# EasyEDA Pro project ZeptoWatch.eprj, board PCB1
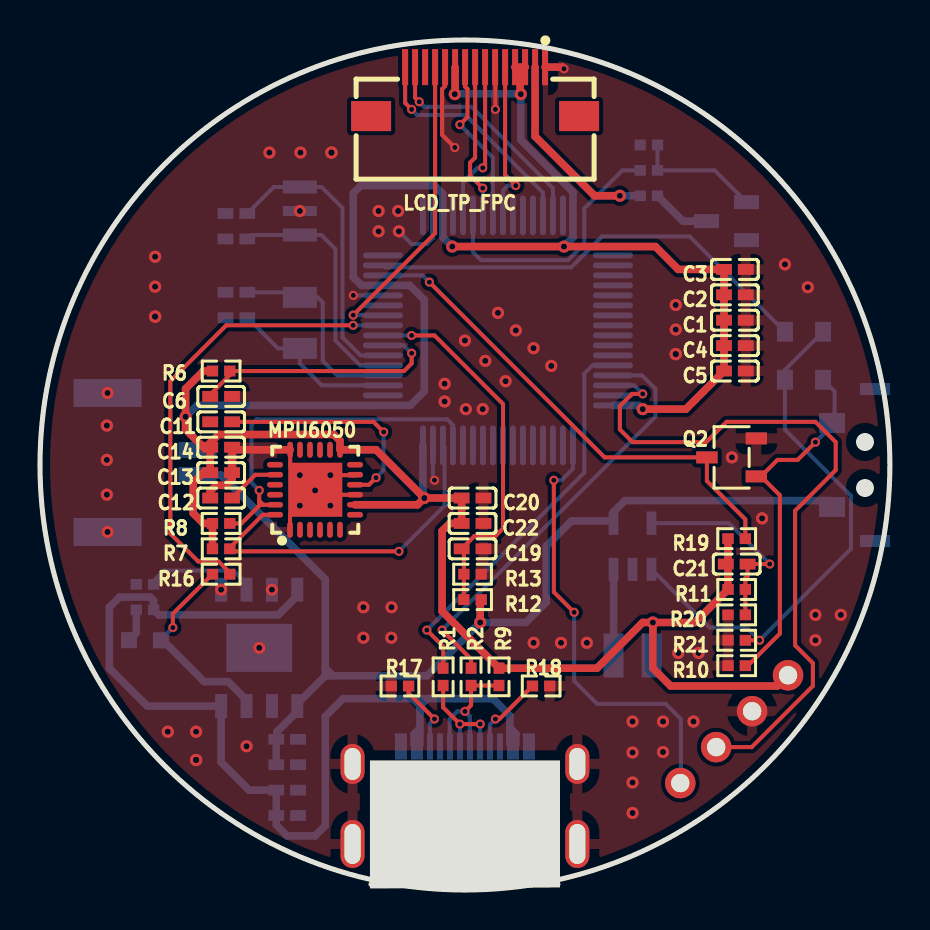
[diagram p6: board, top side]
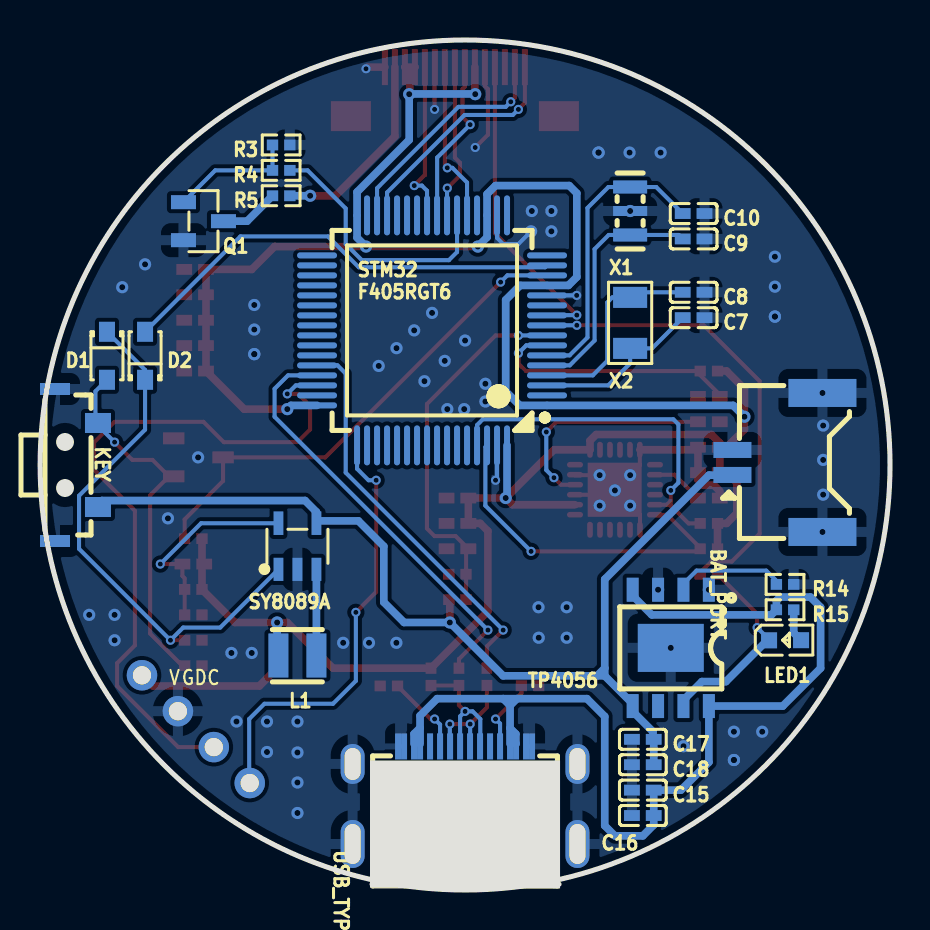
[diagram p7: board, bottom side, seen from below]

Outline 42.5 x 42.5 mm; copper layers: Top Layer, Bottom Layer. Coordinates in mm from the lower left corner of the outline.
Outline path: circle c21.25,21.25 r21.25
Stack: Top Layer 0.035mm / Dielectric1 1.51mm FR4 er 4.5 / Bottom Layer 0.035mm

## Design rules (mm)
spacing safeClearance (default): track to track 0.102, other pairs 0 to 0.3
track width trackWidth (default): min 0.127, default 0.254, max 2.54
differential pair differentialPair (default): width min 0.127, default 0.254, max 2.54; gap min 0.152, default 0.152
via viaSize (default): diameter min 0.305, default 0.457, max 10; hole min 0.152, default 0.254, max 5.999

## Placement (name value [footprint] x y rotation side)
BAT_PORT  1.25K-CB-2PWB  [CONN-SMD_2P-P1.25_L5.5-W7.7-2PWB]  5.63 21.38 90 bottom
C1  100nF  [C0402]  34.75 28.49 0 top
C2  100nF  [C0402]  34.75 29.76 0 top
C3  100nF  [C0402]  34.75 31.03 0 top
C4  100nF  [C0402]  34.75 27.22 0 top
C5  100nF  [C0402]  34.75 25.95 180 top
C6  100nF  [C0402]  9.06 24.68 180 top
C7  10pF  [C0402]  9.82 28.62 0 bottom
C8  10pF  [C0402]  9.82 29.89 0 bottom
C9  20pF  [C0402]  9.82 32.55 0 bottom
C10  20pF  [C0402]  9.82 33.82 0 bottom
C11  100nF  [C0402]  9.06 23.41 180 top
C12  2.2nF  [C0402]  9.06 19.6 180 top
C13  100nF  [C0402]  9.06 20.87 180 top
C14  100nF  [C0402]  9.06 22.14 180 top
C15  10uF  [C0402]  12.36 4.99 180 bottom
C16  100nF  [C0402]  12.36 3.72 0 bottom
C17  10uF  [C0402]  12.36 7.53 180 bottom
C18  100nF  [C0402]  12.36 6.26 0 bottom
C19  100nF  [C0402]  21.63 17.06 0 top
C20  10uF  [C0402]  21.63 19.6 180 top
C21  22pF  [C0402]  34.84 16.3 0 top
C22  100nF  [C0402]  21.63 18.33 0 top
D1  B5819WS  [SOD-323_L1.8-W1.3-LS2.5-FD]  39.16 26.71 90 bottom
D2  B5819WS  [SOD-323_L1.8-W1.3-LS2.5-FD]  37.25 26.71 270 bottom
KEY  TS-KG012EV  [SW-SMD_TS-KG012EV]  40.68 21.25 270 bottom
L1  2.2uH  [IND-SMD_L2.5-W2.0_SWPA252012S]  29.63 11.72 0 bottom
LCD_TP_FPC  KH-FG0.5-H2.0-15PIN  [FPC-SMD_15P-P0.50_KINGHELM_KH-FG0.5-H2.0-15PIN]  21.76 39.92 0 top
LED1  D-060306B1  [LED0603-RD]  5.25 12.49 180 bottom
MPU6050  MPU-6050  [QFN-24_L4.0-W4.0-P0.50-BL-EP2.7]  13.75 20.01 0 top
NOREF  -  [Pad_e10368]  35.61 8.94 0 top
NOREF#2  -  [Pad_e10372]  32.02 5.35 0 top
NOREF#3  -  [Pad_e10366]  37.41 10.74 0 top
NOREF#4  -  [Pad_e10369]  33.81 7.14 0 top
Q1  SS8050  [SOT-23-3_L2.9-W1.3-P1.90-LS2.4-BR]  34.33 33.44 0 bottom
Q2  AO3400A  [SOT-23-3_L2.9-W1.6-P1.90-LS2.8-BR]  34.59 21.63 0 top
R1  22Ω  [R0402]  20.16 10.66 90 top
R2  22Ω  [R0402]  21.56 10.66 90 top
R3  10kΩ  [R0402]  30.45 37.25 180 bottom
R4  1kΩ  [R0402]  30.45 35.98 0 bottom
R5  10Ω  [R0402]  30.45 34.71 180 bottom
R6  47kΩ  [R0402]  9.06 25.95 180 top
R7  2.2kΩ  [R0402]  9.06 17.06 0 top
R8  2.2kΩ  [R0402]  9.06 18.33 0 top
R9  1.5kΩ  [R0402]  22.95 10.66 270 top
R10  10kΩ  [R0402]  34.84 11.22 180 top
R11  100kΩ  [R0402]  34.84 15.03 0 top
R12  20kΩ  [R0402]  21.63 14.52 180 top
R13  20kΩ  [R0402]  21.63 15.79 0 top
R14  2kΩ  [R0402]  5.25 15.28 0 bottom
R15  1kΩ  [R0402]  5.25 14.01 180 bottom
R16  2kΩ  [R0402]  9.06 15.79 0 top
R17  5.1kΩ  [R0402]  18 10.2 0 top
R18  5.1kΩ  [R0402]  25.06 10.2 0 top
R19  100kΩ  [R0402]  34.84 17.57 180 top
R20  22kΩ  [R0402]  34.84 13.76 0 top
R21  100kΩ  [R0402]  34.84 12.49 0 top
STM32
F405RGT6  -  [LQFP-64_L10.0-W10.0-P0.50-LS12.0-BL]  22.9 27.98 90 bottom
SY8089A  SY8089A1AAC  [SOT-23-5_L3.0-W1.7-P0.95-LS2.8-BL]  29.63 17.19 180 bottom
TP4056  TP4056  [ESOP-8_L4.9-W3.9-P1.27-LS6.0-BL-EP]  10.96 12.11 0 bottom
USB_TYPEC  TYPE-C-16M-005  [USB-C-SMD_TYPE-C-16M-005]  21.25 4.74 180 bottom
X1  8MHz  [OSC-SMD_3P-L3.2-W1.3-P1.2-L]  13 33.95 90 bottom
X2  32.768kHz  [OSC-SMD_L3.2-W1.5]  13 28.36 270 bottom

## Footprints (pads in the part's own frame, mm; a bottom-side part is the same pattern mirrored in y, then rotated)
C0402
  rect 0.79x0.54 smd: 1(-0.545,0) 2(0.545,0)
CONN-SMD_2P-P1.25_L5.5-W7.7-2PWB
  rect 0.8x1.9 smd: 1(-0.625,2.25) 2(0.625,2.25)
  rect 1.4x3.4 smd: 3(3.475,-2.25) 4(-3.475,-2.25)
ESOP-8_L4.9-W3.9-P1.27-LS6.0-BL-EP
  rect 0.6x1.2 smd: 1(-1.905,-2.909) 2(-0.635,-2.909) 3(0.635,-2.909) 4(1.905,-2.909) 5(1.905,2.909) 6(0.635,2.909) 7(-0.635,2.909) 8(-1.905,2.909)
  rect 3.3x2.4 smd: 9(0,0)
FPC-SMD_15P-P0.50_KINGHELM_KH-FG0.5-H2.0-15PIN
  rect 0.3x1.8 smd: 1(3.5,1.225) 2(3,1.225) 3(2.5,1.225) 4(2,1.225) 5(1.5,1.225) 6(1,1.225) 7(0.5,1.225) 8(0,1.225) 9(-0.5,1.225) 10(-1,1.225) 11(-1.5,1.225) 12(-2,1.225) 13(-2.499,1.225) 14(-3,1.225) 15(-3.499,1.225)
  rect 2x1.5 smd: 16(-5.2,-1.225) 17(5.2,-1.225)
IND-SMD_L2.5-W2.0_SWPA252012S
  rect 1.001x2.2 smd: 1(-0.95,0) 2(0.95,0)
LED0603-RD
  rect 0.8x0.8 smd: 1(-0.799,-0.004) 2(0.799,0.004)
LQFP-64_L10.0-W10.0-P0.50-LS12.0-BL
  oval 0.3x2 smd: 1(-3.75,-5.75) 2(-3.25,-5.75) 3(-2.75,-5.75) 4(-2.25,-5.75) 5(-1.75,-5.75) 6(-1.25,-5.75) 7(-0.75,-5.75) 8(-0.25,-5.75) 9(0.25,-5.75) 10(0.75,-5.75) 11(1.25,-5.75) 12(1.75,-5.75) 13(2.25,-5.75) 14(2.75,-5.75) 15(3.25,-5.75) 16(3.75,-5.75) 33(3.75,5.75) 34(3.25,5.75) 35(2.75,5.75) 36(2.25,5.75) 37(1.75,5.75) 38(1.25,5.75) 39(0.75,5.75) 40(0.25,5.75) 41(-0.25,5.75) 42(-0.75,5.75) 43(-1.25,5.75) 44(-1.75,5.75) 45(-2.25,5.75) 46(-2.75,5.75) 47(-3.25,5.75) 48(-3.75,5.75)
  oval 2x0.3 smd: 17(5.75,-3.75) 18(5.75,-3.25) 19(5.75,-2.75) 20(5.75,-2.25) 21(5.75,-1.75) 22(5.75,-1.25) 23(5.75,-0.75) 24(5.75,-0.25) 25(5.75,0.25) 26(5.75,0.75) 27(5.75,1.25) 28(5.75,1.75) 29(5.75,2.25) 30(5.75,2.75) 31(5.75,3.25) 32(5.75,3.75) 49(-5.75,3.75) 50(-5.75,3.25) 51(-5.75,2.75) 52(-5.75,2.25) 53(-5.75,1.75) 54(-5.75,1.25) 55(-5.75,0.75) 56(-5.75,0.25) 57(-5.75,-0.25) 58(-5.75,-0.75) 59(-5.75,-1.25) 60(-5.75,-1.75) 61(-5.75,-2.25) 62(-5.75,-2.75) 63(-5.75,-3.25) 64(-5.75,-3.75)
OSC-SMD_3P-L3.2-W1.3-P1.2-L
  rect 0.65x1.7 smd: 1(-1.199,0) 3(1.199,0)
  rect 0.5x1.7 smd: 2(0,0)
OSC-SMD_L3.2-W1.5
  rect 1.049x1.7 smd: 1(-1.275,0) 2(1.275,0)
Pad_e10366
  round 1.524 hole 0.914: 1(0,0)
Pad_e10368
  round 1.524 hole 0.914: 2(0,0)
Pad_e10369
  round 1.524 hole 0.914: 3(0,0)
Pad_e10372
  round 1.524 hole 0.914: 4(0,0)
QFN-24_L4.0-W4.0-P0.50-BL-EP2.7
  oval 0.28x0.8 smd: 1(-1.25,-2) 2(-0.75,-2) 3(-0.25,-2) 4(0.25,-2) 5(0.75,-2) 6(1.25,-2) 13(1.25,2) 14(0.75,2) 15(0.25,2) 16(-0.25,2) 17(-0.75,2) 18(-1.242,2)
  oval 0.8x0.28 smd: 7(2,-1.25) 8(2,-0.75) 9(2,-0.25) 10(2,0.25) 11(2,0.75) 12(2,1.25) 19(-2,1.25) 20(-2,0.75) 21(-2,0.25) 22(-2,-0.25) 23(-2,-0.75) 24(-2,-1.25)
  rect 2.7x2.7 smd: 25(0.013,0)
R0402
  rect 0.566x0.54 smd: 1(-0.433,0) 2(0.433,0)
SOD-323_L1.8-W1.3-LS2.5-FD
  rect 1x0.8 smd: 1(-1.2,0) 2(1.2,0)
SOT-23-3_L2.9-W1.3-P1.90-LS2.4-BR
  rect 1.25x0.7 smd: 1(1,-0.95) 2(1,0.95) 3(-1,0)
SOT-23-3_L2.9-W1.6-P1.90-LS2.8-BR
  rect 1.07x0.6 smd: 1(1.235,-0.95) 2(1.235,0.95) 3(-1.235,0)
SOT-23-5_L3.0-W1.7-P0.95-LS2.8-BL
  rect 0.49x1.157 smd: 1(-0.95,-1.153) 2(0,-1.153) 3(0.95,-1.153)
  rect 0.49x1.175 smd: 4(0.95,1.153) 5(-0.95,1.153)
SW-SMD_TS-KG012EV
  rect 1.001x1.3 smd: 1(2.1,1.075) 2(-2.1,1.075)
  rect 0.6x1.501 smd: 3(-3.8,-1.075) 4(3.8,-1.075)
USB-C-SMD_TYPE-C-16M-005
  oval 1.199x1.999 hole 0.8x1.6: 17(5.621,1.562) 20(-5.621,1.562)
  oval 1.199x2.401 hole 0.8x1.999: 18(5.621,-2.438) 19(-5.621,-2.438)
  rect 0.299x1.3 smd: A1(-3.35,2.438) A4(-2.55,2.438) A5(-1.25,2.438) A6(-0.249,2.438) A7(0.249,2.438) A8(1.25,2.438) A9(2.55,2.438) A12(3.35,2.438) B1(3.05,2.438) B4(2.251,2.438) B5(1.75,2.438) B6(0.75,2.438) B7(-0.75,2.438) B8(-1.75,2.438) B9(-2.251,2.438) B12(-3.05,2.438)

## Nets
GND: BAT_PORT.2 BAT_PORT.3 BAT_PORT.4 C1.2 C2.2 C3.2 C4.2 C5.1 C6.1 C7.1 C8.1 C9.1 C10.1 C11.2 C12.2 C13.1 C14.1 C15.1 C16.2 C17.1 C18.2 C19.2 C20.1 C22.2 KEY.3 KEY.4 LCD_TP_FPC.1 LCD_TP_FPC.6 LCD_TP_FPC.11 MPU6050.1 MPU6050.9 MPU6050.11 MPU6050.18 MPU6050.25 NOREF.2 Q1.2 Q2.2 R3.2 R10.2 R13.2 R14.1 R17.1 R18.2 R20.1 R21.1 STM32
F405RGT6.12 STM32
F405RGT6.18 STM32
F405RGT6.63 SY8089A.2 TP4056.1 TP4056.3 TP4056.9 USB_TYPEC.17 USB_TYPEC.18 USB_TYPEC.19 USB_TYPEC.20 USB_TYPEC.A1 USB_TYPEC.A12 USB_TYPEC.B1 USB_TYPEC.B12 X1.2
VBAT: BAT_PORT.1 C17.2 C18.1 KEY.1 R12.1 SY8089A.4 TP4056.5
VBUS: C15.2 C16.1 R15.1 TP4056.4 TP4056.8 USB_TYPEC.A4 USB_TYPEC.A9 USB_TYPEC.B4 USB_TYPEC.B9
VCC_3V3: C1.1 C2.1 C3.1 C4.1 C5.2 C13.2 C14.2 C20.2 C21.1 C22.1 L1.2 LCD_TP_FPC.3 LCD_TP_FPC.4 LCD_TP_FPC.10 MPU6050.8 MPU6050.13 NOREF#3.1 R6.2 R7.1 R8.1 R9.1 R11.1 R19.2 STM32
F405RGT6.1 STM32
F405RGT6.13 STM32
F405RGT6.19 STM32
F405RGT6.32 STM32
F405RGT6.48 STM32
F405RGT6.64
BAT_ADC: C19.1 R12.2 R13.1 STM32
F405RGT6.8
BAT_CHRG_R: R16.2 STM32
F405RGT6.9
I2S_CK: STM32
F405RGT6.51
I2S_SD: STM32
F405RGT6.53
I2S_WS: STM32
F405RGT6.20
IMU_SCL: MPU6050.23 R8.2 STM32
F405RGT6.61
IMU_SDA: MPU6050.24 R7.2 STM32
F405RGT6.62
KEY_ON_R: Q2.3 R19.1 STM32
F405RGT6.14
LCD_BLK: R4.1 STM32
F405RGT6.22
LCD_DC: LCD_TP_FPC.5 STM32
F405RGT6.25
LCD_LEDK: LCD_TP_FPC.2 R5.2
LCD_RST: LCD_TP_FPC.9 STM32
F405RGT6.24
LCD_SCL: LCD_TP_FPC.7 STM32
F405RGT6.21
LCD_SDA: LCD_TP_FPC.8 STM32
F405RGT6.23
OLED_SCL: STM32
F405RGT6.56
OLED_SDA: STM32
F405RGT6.55
OSC32_IN: C7.2 STM32
F405RGT6.3 X2.2
OSC32_OUT: C8.2 STM32
F405RGT6.4 X2.1
OSC_IN: C9.2 STM32
F405RGT6.5 X1.1
OSC_OUT: C10.2 STM32
F405RGT6.6 X1.3
PWR_ON: D2.1 STM32
F405RGT6.15
SWCLK: NOREF#2.4 STM32
F405RGT6.49
SWDIO: NOREF#4.3 STM32
F405RGT6.46
TP_RST: LCD_TP_FPC.12 STM32
F405RGT6.10
TP_SCL: LCD_TP_FPC.15 STM32
F405RGT6.29
TP_SDA: LCD_TP_FPC.14 STM32
F405RGT6.30
UART_RX: STM32
F405RGT6.17
UART_TX: STM32
F405RGT6.16
USB_DN: R1.2 STM32
F405RGT6.44
USB_DN_IN: R1.1 USB_TYPEC.A7 USB_TYPEC.B7
USB_DP: R2.2 STM32
F405RGT6.45
USB_DP_IN: R2.1 R9.2 USB_TYPEC.A6 USB_TYPEC.B6
$1N9238: Q1.3 R5.1
$1N9425: Q1.1 R3.1 R4.2
$1N10592: C6.2 R6.1 STM32
F405RGT6.7
$1N15962: C11.1 MPU6050.10
$1N17008: C12.1 MPU6050.20
$1N32778: R14.2 TP4056.2
$1N37022: LED1.2 R15.2
$1N38725: LED1.1 R16.1 TP4056.7
$1N43806: R17.2 USB_TYPEC.B5
$1N44125: R18.1 USB_TYPEC.A5
$1N53709: D1.1 KEY.2 Q2.1 R10.1
$1N56463: D1.2 D2.2 R21.2 SY8089A.1
$1N59957: L1.1 SY8089A.3
$1N60626: C21.2 R11.2 R20.2 SY8089A.5

Pads without a net: LCD_TP_FPC 13 16 17; MPU6050 2 3 4 5 6 7 12 14 15 16 17 19 21 22; STM32
F405RGT6 2 11 26 27 28 31 33 34 35 36 37 38 39 40 41 42 43 47 50 52 54 57 58 59 60; TP4056 6; USB_TYPEC A8 B8

## Via types
v1: diameter 0.61, hole 0.305, Top Layer to Bottom Layer, 79 vias
v2: diameter 0.457, hole 0.254, Top Layer to Bottom Layer, 34 vias

## Routing (per net, layer and track width the routed paths; a pad name or vN(x,y) marks a point on that pad's centre or on a via; arc(x,y) is an arc through that point)
GND: length 32.2
  Top Layer w0.203: MPU6050.9 15.06,19.76 v1(14.52,19.22) v1(13.76,19.98) ; v1(13.76,19.98) v1(14.52,20.74) 15.73,20.74 MPU6050.11 ; v1(13.76,19.98) v1(13,20.74) ; v1(13.76,19.98) v1(13,19.22) ; v2(22.77,39.03) 22.77,41.13 LCD_TP_FPC.6 ; LCD_TP_FPC.11 20.26,40.2 20.11,40.05 20.11,37.76 v2(20.74,37.12) ; MPU6050.18 12.51,21.23 v1(13,20.74) ; v1(13,20.74) 13,19.26 12.5,18.77 MPU6050.1
  Top Layer w0.381: v2(26.2,41.06) 26.12,41.14 LCD_TP_FPC.1 ; C12.2 8.51,19.94 8.8,20.23 9.31,20.23 9.6,20.53 C13.1 C14.1 9.73,22.01 MPU6050.18
  Bottom Layer w0.203: v1(17.95,32.93) 18.58,32.3 19.34,32.3 19.65,32.61 STM32
F405RGT6.18 ; USB_TYPEC.A12 USB_TYPEC.B1 ; STM32
F405RGT6.12 v2(15.67,29.73) ; STM32
F405RGT6.63 19.65,20.56 v2(19.73,20.49) ; USB_TYPEC.A1 USB_TYPEC.B12
  vias: v1(3.38,24.85) v1(3.34,23.22) v1(3.34,21.5) v1(3.34,19.77) v1(3.38,17.9) v1(5.76,31.66) v1(5.76,30.17) v1(5.76,28.67) v1(5.76,28.67) v1(6.39,7.92) v1(7.81,7.92) v1(7.81,6.5) v1(7.81,6.5) v1(9.06,15.01) v1(10.33,7.19) v1(10.96,12.11) v1(11.47,36.87) v1(11.6,15.01) v1(13,33.95) v1(13.02,36.87) v1(14.58,36.87) v1(14.58,36.87) v1(16.17,14.14) v1(16.17,12.61) v1(16.93,33.95) v1(16.93,32.93) v1(17.58,14.14) v1(17.57,12.61) v1(17.91,33.95) v1(20.23,25.31) v1(20.23,24.42) v1(21.25,27.47) v1(21.29,24.04) v1(22.14,24.04) v1(22.27,26.46) v1(22.9,28.86) v1(23.28,25.44) v1(23.79,27.98) v1(24.68,27.09) v1(24.69,12.36) v1(25.57,26.2) v1(26.05,12.36) v1(27.35,12.36) v1(29.63,8.42) v1(29.63,6.88) v1(29.63,5.38) v1(29.63,3.85) v1(31.16,8.42) v1(31.16,6.9) v1(31.79,29.25) v1(31.79,28.02) v1(31.79,26.79) v1(31.79,26.79) v1(31.92,11.85) v1(32.68,8.42) v1(32.93,11.85) v1(34.6,21.63) v1(36.11,18.58) v1(37.25,31.28) v1(38.4,30.14) v1(38.78,13.76) v1(38.78,12.49) v1(40.05,13.76)
VBAT: length 51.5
  Top Layer w0.381: v1(22.01,13.38) 22.01,14.47 R12.1
  Bottom Layer w0.381: 14.26,11.09 14.65,10.71 ; 14.26,11.09 14.26,10.71 ; 14.26,11.09 14.26,15.53 9.06,20.74 7.89,20.74 BAT_PORT.1 ; 14.26,10.71 19.34,10.71 v1(22.01,13.38) 24.3,13.38 25.31,14.39 25.31,17.19 26.58,18.46 28.57,18.46 SY8089A.4 28.68,18.9 29.25,19.47 39.41,19.47 39.73,19.15 ; 14.26,10.71 12.87,9.31 ; 11.81,6.26 11.81,7.53 11.85,7.57 11.85,7.92 12.87,8.93
VBUS: length 52.7
  Bottom Layer w0.381: 19.34,9.57 18.65,9.57 ; 19.34,9.57 19,9.22 ; 19.34,9.57 22.65,9.57 23.5,8.71 23.5,8.11 ; 18.65,9.57 19,9.22 ; 18.65,9.57 15.15,9.57 14.26,8.68 14.26,3.22 13.76,2.71 12.36,2.71 11.81,3.25 11.81,4.99 10.46,4.99 9.06,6.39 TP4056.8 5.36,9.2 3.47,11.09 3.47,14.14 3.98,14.65 5.5,14.65 5.68,14.47 5.68,14.01 5.94,13.76 11.91,13.76 12.87,14.71 TP4056.4 ; 19,7.31 19,8.09 ; 19,8.09 18.71,7.8 18.71,7.32 18.7,7.31 ; 19,8.09 19,9.22 ; 23.5,8.11 23.8,7.81 23.8,7.31 ; 23.5,8.11 23.5,7.31
VCC_3V3: length 144.3
  Top Layer w0.381: v1(19.22,19.6) 18.88,19.26 MPU6050.8 ; v1(19.22,19.6) 16.81,22.01 MPU6050.13 15,22.46 14.69,22.77 8.93,22.77 8.51,22.36 C14.2 ; v1(19.22,19.6) C20.2 C22.1 20.49,18.33 20.11,17.95 20.11,13.94 R9.1 27.85,11.09 30.14,13.38 v1(30.65,13.38) ; NOREF#3.1 36.87,10.2 31.54,10.2 30.65,11.09 v1(30.65,13.38) ; R19.2 34.41,16.41 C21.1 34.41,16.18 R11.1 32.75,13.38 v1(30.65,13.38) ; C14.2 8.17,22.14 7.28,23.03 v1(7.28,23.66) 7.28,25.06 8.17,25.95 R6.2 ; C14.2 C13.2 8.17,20.87 7.66,20.36 7.66,18.84 8.17,18.33 R8.1 R7.1 ; 24.01,40.89 LCD_TP_FPC.4 LCD_TP_FPC.3 24.01,40.89 ; 24.01,40.89 24.01,39.83 v1(24.04,39.79) ; v1(20.62,32.17) v1(26.2,32.17) 30.78,32.17 31.92,31.03 C3.1 C2.1 C1.1 C4.1 C5.2 32.3,24.04 v1(30.14,24.04) ; v1(20.74,39.79) 20.76,39.81 LCD_TP_FPC.10
  Bottom Layer w0.381: v1(26.2,32.17) 26.65,32.62 STM32
F405RGT6.32 26.65,34.9 24.04,37.51 v1(24.04,39.79) 24.03,39.8 20.75,39.8 v1(20.74,39.79) ; STM32
F405RGT6.64 19.15,19.67 v1(19.22,19.6) ; L1.2 30.65,11.79 v1(30.65,13.38) ; v1(30.14,24.04) 29.95,24.23 STM32
F405RGT6.48 ; v1(7.28,23.66) 7.85,24.23 STM32
F405RGT6.1 18.52,24.23 19.22,24.93 19.22,29.5 18.49,30.23 STM32
F405RGT6.13 16.08,30.23 15.66,30.65 15.66,34.84 16.04,35.22 19.73,35.22 20.15,34.8 STM32
F405RGT6.19 20.15,32.64 v1(20.62,32.17)
BAT_ADC: length 18.7
  Top Layer w0.203: R12.2 R13.1 21.2,16.95 C19.1 21.72,17.69 22.77,17.69 23.16,18.08 23.16,24.3 19.73,27.73 v2(18.58,27.73)
  Bottom Layer w0.203: STM32
F405RGT6.8 17.16,27.73 v2(18.58,27.73)
BAT_CHRG_R: length 23.3
  Top Layer w0.203: v2(15.66,28.23) 9.31,28.23 6.52,25.44 6.52,17.82 7.91,16.42 8.93,16.42 9.49,15.86 R16.2
  Bottom Layer w0.203: STM32
F405RGT6.9 17.15,28.23 v2(15.66,28.23)
IMU_SCL: length 18.4
  Top Layer w0.203: 11.15,19.26 11.15,19.27 10.96,19.46 ; 11.15,19.26 MPU6050.23 ; 11.15,19.26 11.01,19.26 ; v2(10.96,19.98) 10.96,19.46 ; 10.96,19.46 10.96,19.22 10.07,18.33 R8.2
  Bottom Layer w0.203: STM32
F405RGT6.61 20.65,23.25 20.36,23.54 10.84,23.54 10.58,23.28 10.58,20.36 v2(10.96,19.98)
IMU_SDA: length 17.8
  Top Layer w0.203: MPU6050.24 11.14,18.76 9.49,17.11 R7.2 9.62,16.93 v2(17.95,16.93)
  Bottom Layer w0.203: STM32
F405RGT6.62 20.23,22.15 20.23,19.22 v2(17.95,16.93)
KEY_ON_R: length 24.8
  Top Layer w0.203: v2(19.47,30.39) 28.24,21.63 Q2.3 33.35,20.45 35.27,18.53 R19.1
  Bottom Layer w0.203: STM32
F405RGT6.14 19.13,30.73 v2(19.47,30.39)
LCD_BLK: length 13.3
  Bottom Layer w0.203: R4.1 29.12,35.98 27.22,34.08 27.22,32.3 26.41,31.49 22.06,31.49 21.65,31.9 STM32
F405RGT6.22
LCD_DC: length 8.1
  Top Layer w0.203: v2(23.79,35.22) 23.26,35.75 LCD_TP_FPC.5
  Bottom Layer w0.203: 23.16,33.73 STM32
F405RGT6.25 23.15,34.96 23.41,35.22 v2(23.79,35.22)
LCD_LEDK: length 9.9
  Top Layer w0.381: v1(29,34.71) 27.73,34.71 24.76,37.68 LCD_TP_FPC.2
  Bottom Layer w0.381: v1(29,34.71) R5.2
LCD_RST: length 8.3
  Top Layer w0.203: LCD_TP_FPC.9 21.26,40.17 21.38,40.05 21.38,38.65 v2(21,38.27)
  Bottom Layer w0.203: v2(21,38.27) 22.65,36.62 22.65,33.73 STM32
F405RGT6.24
LCD_SCL: length 8
  Top Layer w0.203: LCD_TP_FPC.7 22.26,36.23 v2(22.14,36.11)
  Bottom Layer w0.203: STM32
F405RGT6.21 21.15,35.38 21.88,36.11 v2(22.14,36.11)
LCD_SDA: length 7.8
  Top Layer w0.203: v2(22.14,35.09) 21.5,35.73 21.5,36.36 21.76,36.62 LCD_TP_FPC.8
  Bottom Layer w0.203: STM32
F405RGT6.23 22.15,35.08 v2(22.14,35.09)
OSC32_IN: length 8.6
  Bottom Layer w0.203: 10.37,28.62 11.9,27.08 X2.2 13,26.33 14.09,25.23 STM32
F405RGT6.3
OSC32_OUT: length 10.2
  Bottom Layer w0.203: STM32
F405RGT6.4 14.86,25.73 14.14,26.46 14.14,29.38 13.88,29.63 X2.1 12.74,29.89 10.37,29.89
OSC_IN: length 12.2
  Bottom Layer w0.203: 10.37,32.55 10.56,32.75 X1.1 14.07,32.75 14.77,32.05 14.77,27.47 16.01,26.23 STM32
F405RGT6.5
OSC_OUT: length 14.6
  Bottom Layer w0.203: 10.37,33.82 11.69,35.15 X1.3 14.08,35.15 15.13,34.1 15.13,27.63 16.02,26.73 STM32
F405RGT6.6
PWR_ON: length 22.8
  Bottom Layer w0.203: D2.1 32.48,32.68 28.11,32.68 26.56,31.14 17.25,31.14 STM32
F405RGT6.15
SWCLK: length 22.2
  Top Layer w0.203: v2(26.71,13.88) 25.69,14.9 v2(25.69,20.49)
  Bottom Layer w0.203: NOREF#2.4 32.04,5.38 32.04,8.55 31.28,9.31 27.85,9.31 26.71,10.45 v2(26.71,13.88) ; v2(25.69,20.49) 26.08,20.49 26.65,21.06 STM32
F405RGT6.49
SWDIO: length 35.6
  Top Layer w0.203: NOREF#4.3 35.59,7.14 38.65,10.2 38.65,11.34 37.76,12.23 37.76,18.96 39.79,21 39.79,22.39 38.78,23.41 34.33,23.41 33.31,22.39 29.63,22.39 29,23.03 29,24.2 29.61,24.81 v2(30.14,24.81)
  Bottom Layer w0.203: STM32
F405RGT6.46 29.72,25.23 v2(30.14,24.81)
TP_RST: length 15.6
  Top Layer w0.203: v2(15.66,28.74) 19.76,32.84 LCD_TP_FPC.12
  Bottom Layer w0.203: v2(15.66,28.74) 17.14,28.74 STM32
F405RGT6.10
TP_SCL: length 11.7
  Top Layer w0.203: LCD_TP_FPC.15 18.26,39.35 v2(18.58,39.03)
  Bottom Layer w0.203: v2(18.58,39.03) 18.86,38.75 21.28,38.75 25.15,34.88 STM32
F405RGT6.29
TP_SDA: length 11.7
  Top Layer w0.203: v2(18.96,39.41) 18.76,39.62 LCD_TP_FPC.14
  Bottom Layer w0.203: STM32
F405RGT6.30 25.65,35.09 21.58,39.16 19.22,39.16 v2(18.96,39.41)
USB_DN: length 19.9
  Top Layer w0.203: R1.2 20.16,12.18 v2(19.34,13)
  Bottom Layer w0.203: v2(19.34,13) 27.22,20.87 27.22,25.82 27.63,26.23 STM32
F405RGT6.44
USB_DN_IN: length 5.3
  Top Layer w0.203: v2(22.01,8.3) v2(21,8.3) 20.16,9.13 R1.1
  Bottom Layer w0.203: v2(22.01,8.3) 22.01,7.32 22,7.31 ; 21,7.31 21,7.31 v2(21,8.3)
USB_DP: length 21.4
  Top Layer w0.203: v2(20.11,13) 21.56,11.55 R2.2
  Bottom Layer w0.203: v2(20.11,13) 30.78,23.66 30.78,25.06 30.1,25.73 STM32
F405RGT6.45
USB_DP_IN: length 6.7
  Top Layer w0.203: R2.1 21.43,10.22 ; R2.1 21.56,9.24 v2(21.25,8.93) ; R2.1 22.83,10.22
  Bottom Layer w0.203: 21.5,7.31 21.5,8.68 v2(21.25,8.93) 20.87,8.93 20.49,8.55 20.49,7.32 20.5,7.31
$1N9238: length 3
  Bottom Layer w0.381: R5.1 32.15,33.44 Q1.3
$1N9425: length 6.4
  Bottom Layer w0.203: Q1.1 33.74,35.98 R4.2 R3.1
$1N10592: length 13
  Top Layer w0.203: C6.2 8.51,24.77 9.49,25.75 R6.1 18.2,25.95 18.58,26.33 v2(18.58,26.84)
  Bottom Layer w0.203: v2(18.58,26.84) 18.19,27.23 STM32
F405RGT6.7
$1N15962: length 11.4
  Top Layer w0.203: C11.1 16.68,23.41 v2(17.19,22.9) ; v2(16.81,20.61) 16.45,20.26 MPU6050.10
  Bottom Layer w0.203: v2(16.81,20.61) 17.19,21 v2(17.19,22.9)
$1N17008: length 2.6
  Top Layer w0.203: C12.1 10.77,20.76 MPU6050.20
$1N32778: length 5.6
  Bottom Layer w0.203: TP4056.2 10.33,15.31 9.67,15.97 6.19,15.97 5.68,15.46 5.68,15.28
$1N37022: length 1.7
  Bottom Layer w0.381: R15.2 4.81,12.86 LED1.2
$1N38725: length 10.2
  Top Layer w0.203: R16.1 6.65,13.81 v2(6.65,13.12)
  Bottom Layer w0.203: v2(6.65,13.12) 6.05,12.53 6.05,12.49 LED1.1
  Bottom Layer w0.381: LED1.1 6.14,12.48 8.2,10.42 9.41,10.42 10.33,9.5 TP4056.7
$1N43806: length 3.3
  Top Layer w0.203: 18.43,9.97 18.43,9.84 v2(19.73,8.55)
  Bottom Layer w0.203: 19.5,7.31 19.5,8.32 v2(19.73,8.55)
$1N44125: length 3.9
  Top Layer w0.203: R18.1 22.98,8.55 v2(22.77,8.55)
  Bottom Layer w0.203: v2(22.77,8.55) 22.5,8.28 22.5,7.31
$1N53709: length 18.1
  Top Layer w0.203: 36.06,20.68 Q2.1 ; 36.06,20.68 36.88,21.5 37.89,21.5 v2(38.78,22.39) ; 36.06,20.68 37,19.74 37,12.82 35.39,11.22 R10.1
  Bottom Layer w0.203: v2(38.78,22.39) 39.73,23.35 39.73,24.93 D1.1
$1N56463: length 27.1
  Top Layer w0.203: v2(35.98,12.49) R21.2
  Bottom Layer w0.203: D1.2 37.25,26.01 D2.2 37.25,23.01 40.55,19.71 40.55,17.06 v2(35.98,12.49) 35.35,13.12 33.49,13.12 SY8089A.1
$1N59957: length 4.3
  Bottom Layer w0.381: L1.1 SY8089A.3
$1N60626: length 10.4
  Top Layer w0.203: R20.2 R11.2 35.27,15.59 35.38,15.7 C21.2 v2(36.49,16.3)
  Bottom Layer w0.203: SY8089A.5 34.45,18.34 v2(36.49,16.3)

## Copper pours and planes (outline as drawn; the poured copper is in the pictures)
GND on Top Layer: -0.97,44.62 44.62,44.62 44.62,-2.12 -0.97,-2.12
GND on Bottom Layer: -0.97,44.62 44.62,44.62 44.62,-2.12 -0.97,-2.12

## Text on the board
Bottom Silkscreen Layer: C | D | G | V
